# EAGLE schematic DRI_MainBoard (EAGLE 5.11)
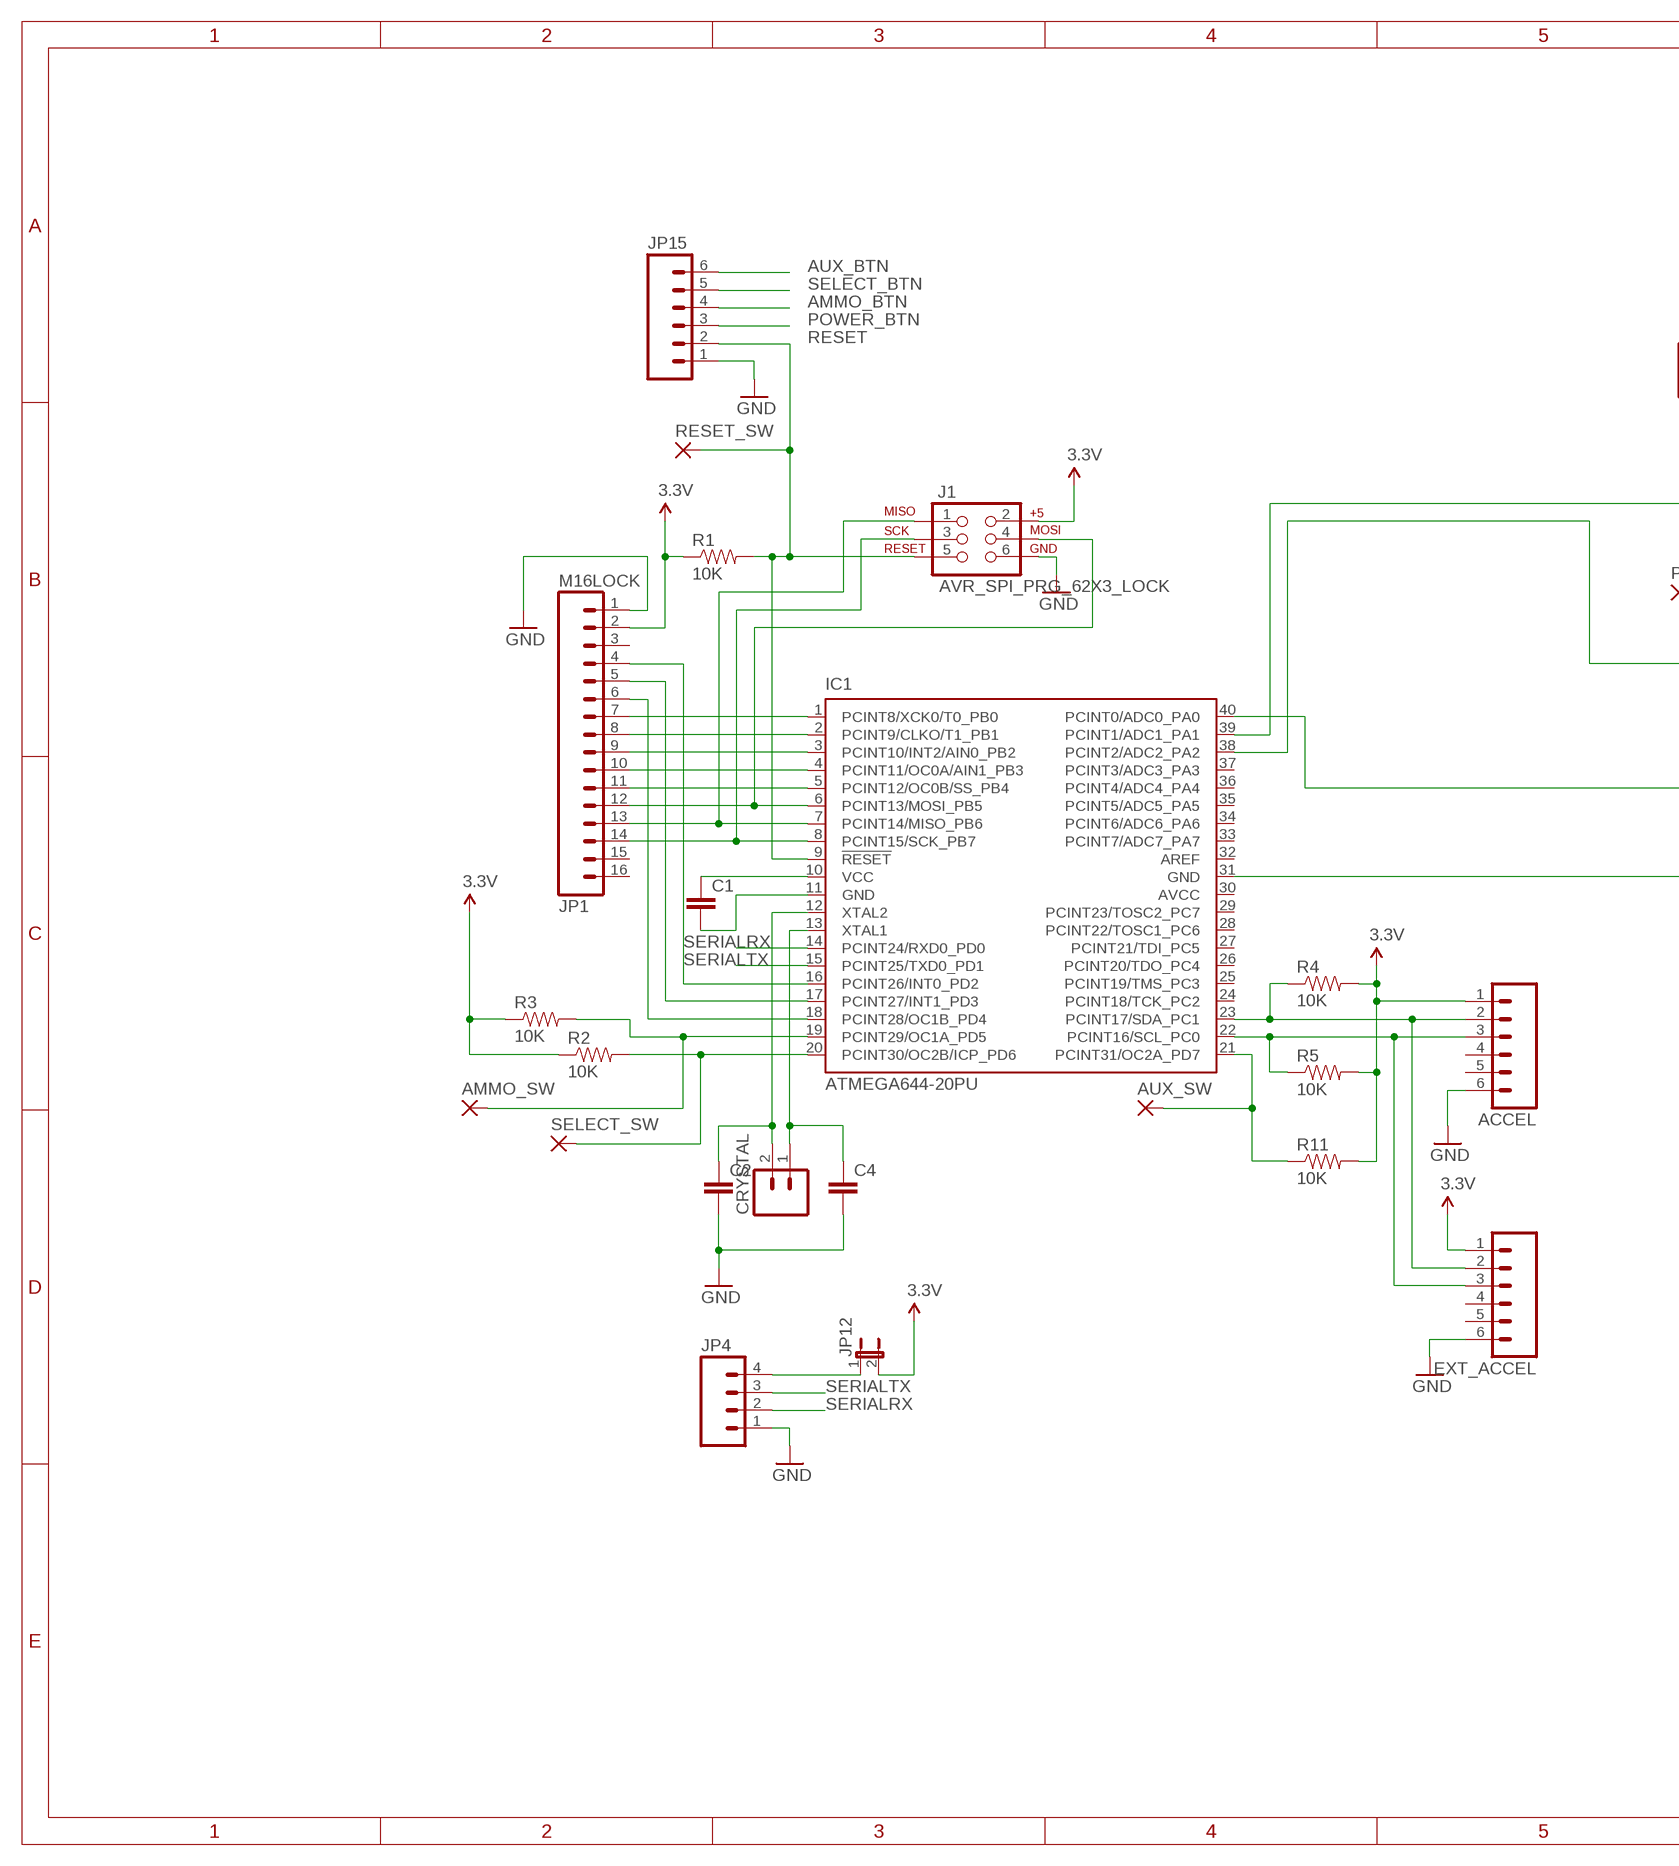
[diagram p0: schematic, sheet 1, part 1 of 2]
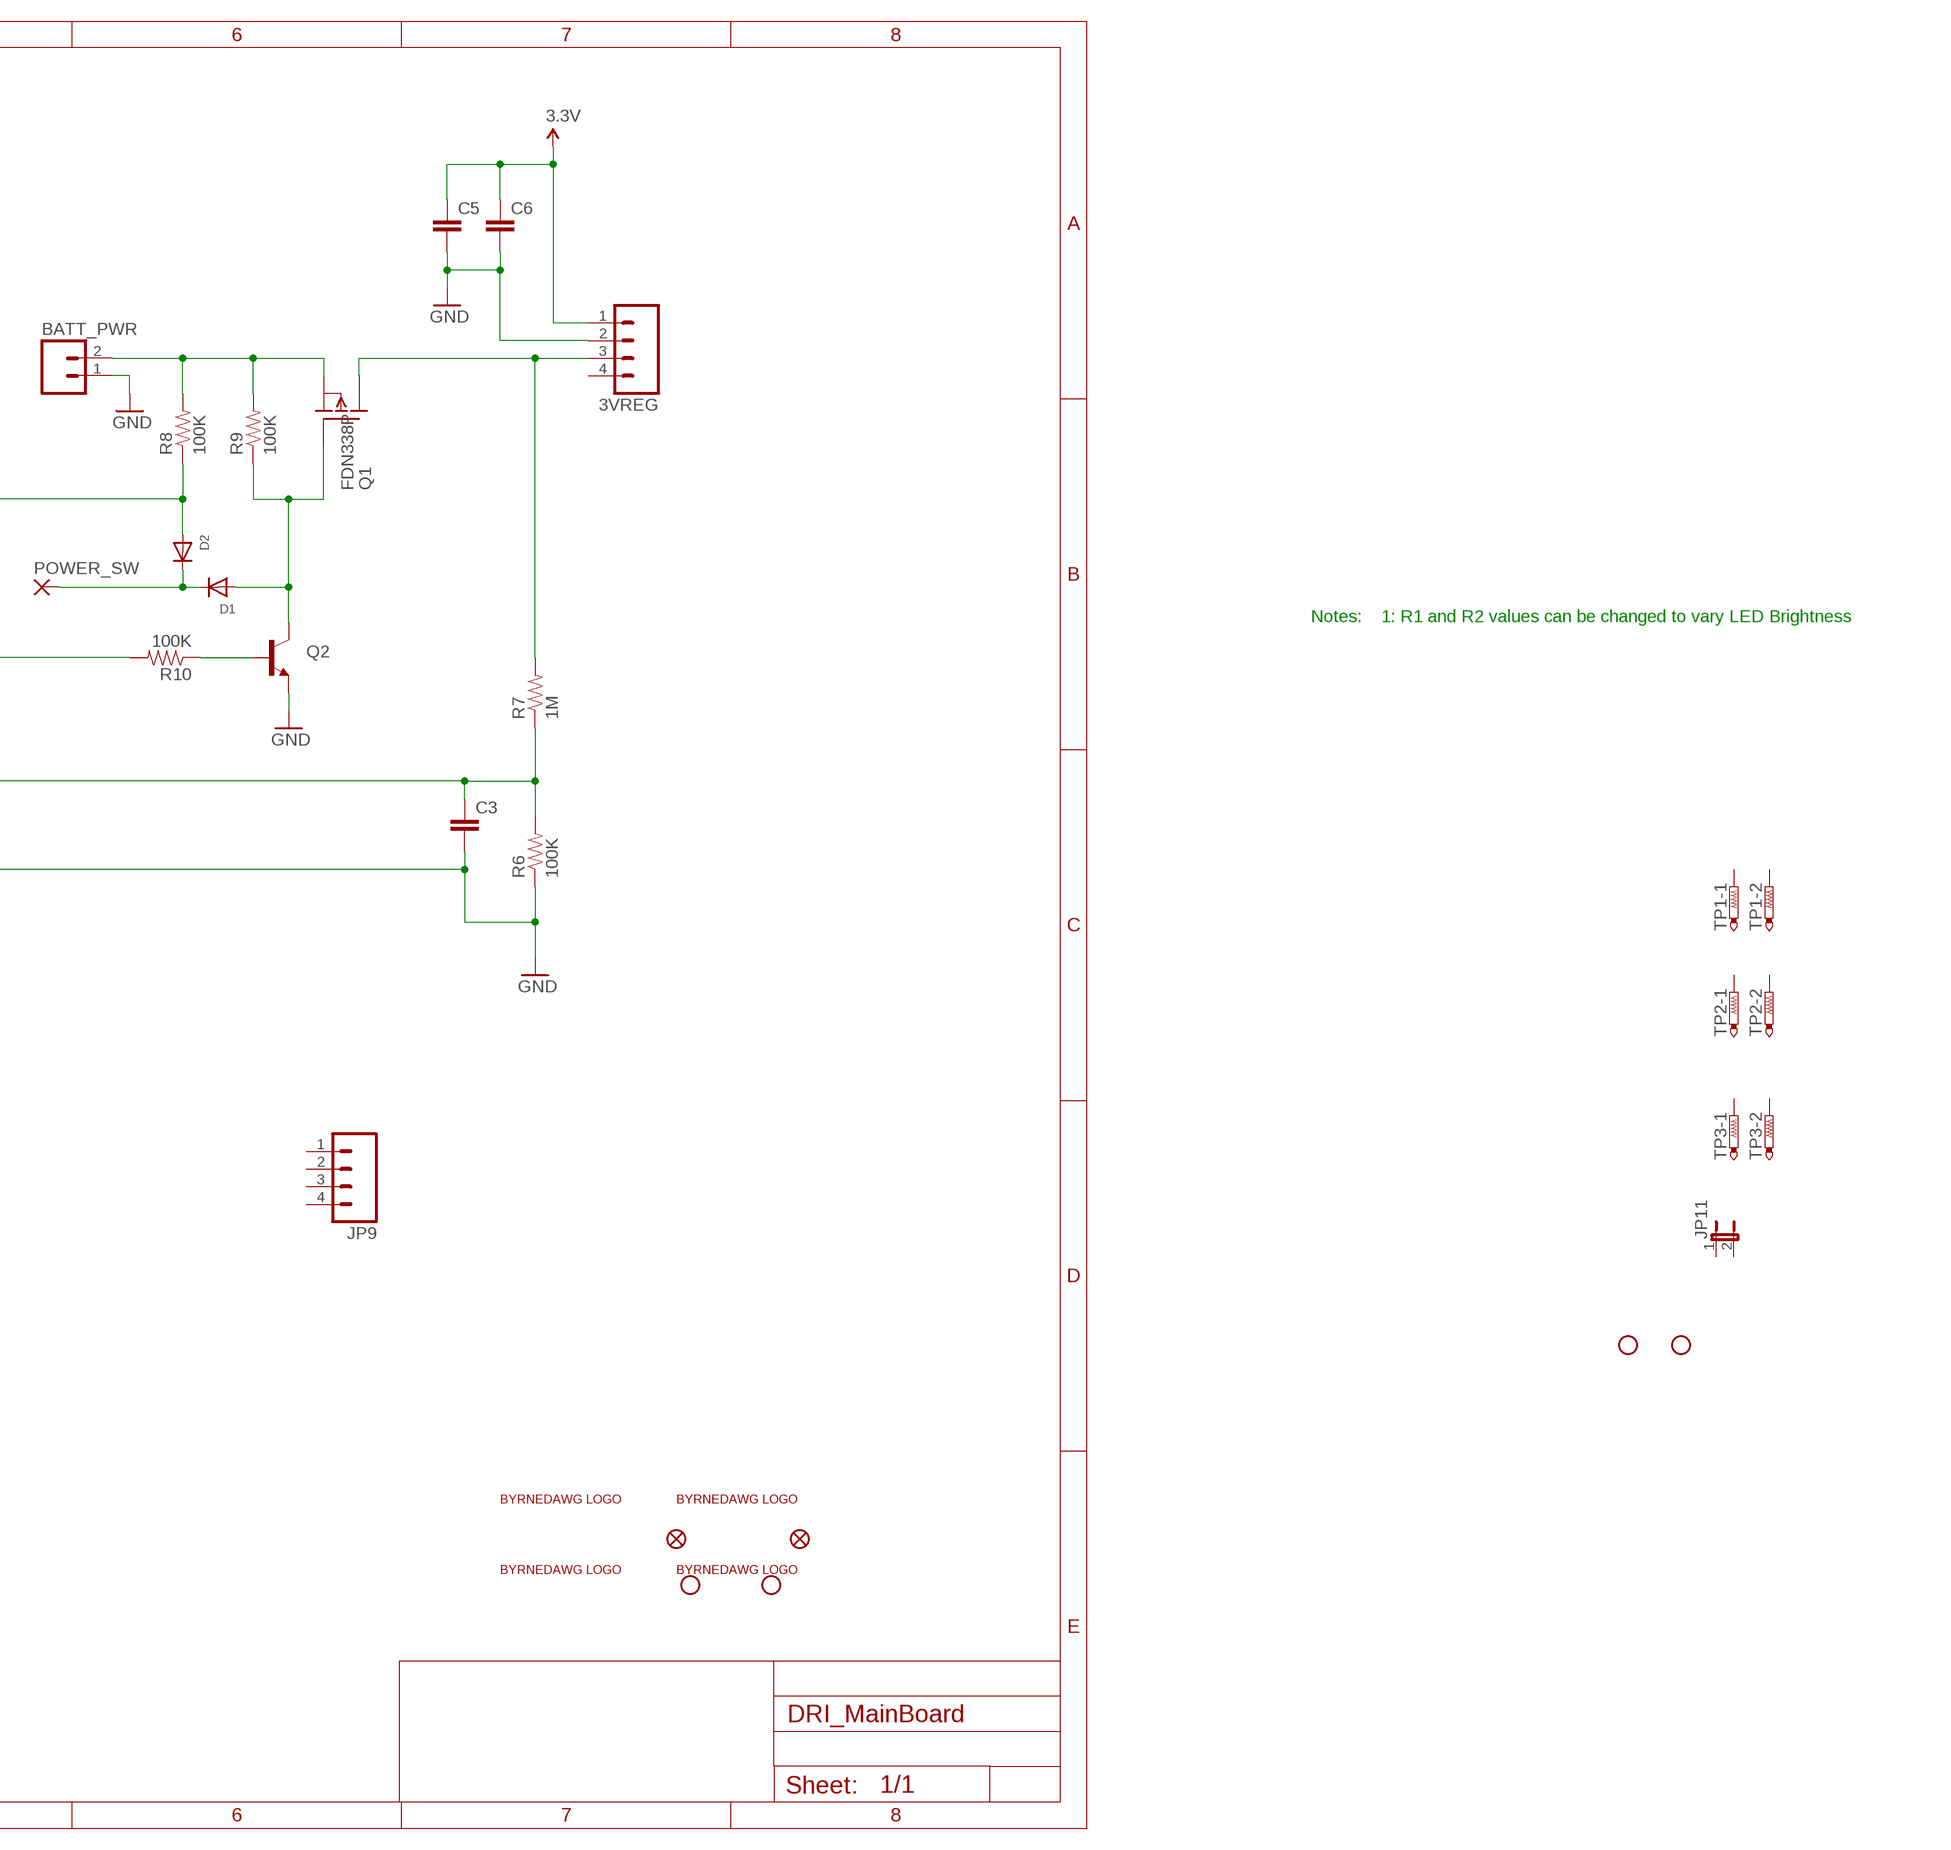
[diagram p1: schematic, sheet 1, part 2 of 2]

## Parts
3VREG  M04LOCK  [1X04_LOCK]
ACCEL  M06LOCK  [1X06_LOCK]
AMMO_SW  1,6/0,9  [1,6/0,9]
AUX_SW  1,6/0,9  [1,6/0,9]
BATT_PWR  M02PTH  [1X02]
C1  CAP1206  [1206]
C2  CAP1206  [1206]
C3  CAP1206  [1206]
C4  CAP1206  [1206]
C5  CAP1206  [1206]
C6  CAP1206  [1206]
CRYSTAL  M02PTH  [1X02]
D1  DIODESOD-123  [SOD-123]
D2  DIODESOD-123  [SOD-123]
EXT_ACCEL  M06LOCK  [1X06_LOCK]
IC1  ATMEGA644-20PU  [DIL40]
J1  AVR_SPI_PRG_62X3_LOCK  [2X3_LOCK]
JP1  M16LOCK  [1X16_LOCK]
JP2  FIDUCIAL1X2  [FIDUCIAL-1X2]
JP3  FIDUCIAL1X2  [FIDUCIAL-1X2]
JP4  M04LOCK  [1X04_LOCK]
JP6  STAND-OFF  [STAND-OFF]
JP7  STAND-OFF  [STAND-OFF]
JP9  M04LOCK  [1X04_LOCK]
JP11  JUMPER-2PTH  [1X02]
JP12  JUMPER-2PTH  [1X02]
JP13  STAND-OFF  [STAND-OFF]
JP14  STAND-OFF  [STAND-OFF]
JP15  M06LOCK  [1X06_LOCK]
POWER_SW  1,6/0,9  [1,6/0,9]
Q1  FDN338P  [SOT23]
Q2  TRANSISTOR_NPNSOT23  [SOT23]
R1  10K  RESISTOR1206  [1206]
R2  10K  RESISTOR1206  [1206]
R3  10K  RESISTOR1206  [1206]
R4  10K  RESISTOR1206  [1206]
R5  10K  RESISTOR1206  [1206]
R6  100K  RESISTOR1206  [1206]
R7  1M  RESISTOR1206  [1206]
R8  100K  RESISTOR1206  [1206]
R9  100K  RESISTOR1206  [1206]
R10  100K  RESISTOR1206  [1206]
R11  10K  RESISTOR1206  [1206]
RESET_SW  1,6/0,9  [1,6/0,9]
SELECT_SW  1,6/0,9  [1,6/0,9]
TP1  PTR2  [P2-38-17]
TP2  PTR2  [P2-38-17]
TP3  PTR2  [P2-38-17]
U$1  BYRNEDAWGBIG_LABEL  [BYRNEDAWGBIGLABEL]
U$2  BYRNEDAWGBIG_LABEL  [BYRNEDAWGBIGLABEL]
U$3  BYRNEDAWGBIG_LABEL  [BYRNEDAWGBIGLABEL]
U$4  BYRNEDAWGBIG_LABEL  [BYRNEDAWGBIGLABEL]

## Nets
3.3V: 3VREG.1 ACCEL.1 C1.1 C5.1 C6.1 EXT_ACCEL.1 IC1.10(VCC) J1.2 JP1.2 JP12.2 R1.1 R2.1 R3.1 R4.2 R5.2 R11.2
AMM0_BTN: AMMO_SW.1(P) IC1.19(PCINT29/OC1A_PD5) R3.2
AMMO_BTN: JP15.4
AUX_BTN: AUX_SW.1(P) IC1.21(PCINT31/OC2A_PD7) JP15.6 R11.1
BATT_POS: BATT_PWR.2 Q1.2(S) R8.2 R9.2
BATTVOLTCHECK: C3.1 IC1.40(PCINT0/ADC0_PA0) R6.2 R7.1
GND: 3VREG.2 ACCEL.6 BATT_PWR.1 C1.2 C2.2 C3.2 C4.2 C5.2 C6.2 EXT_ACCEL.6 IC1.11(GND) IC1.31(GND) J1.6 JP1.1 JP4.1 JP15.1 Q2.2(E) R6.1
N$2: IC1.17(PCINT27/INT1_PD3) JP1.5
N$3: IC1.16(PCINT26/INT0_PD2) JP1.4
N$4: IC1.1(PCINT8/XCK0/T0_PB0) JP1.7
N$5: IC1.2(PCINT9/CLKO/T1_PB1) JP1.8
N$6: IC1.3(PCINT10/INT2/AIN0_PB2) JP1.9
N$7: IC1.4(PCINT11/OC0A/AIN1_PB3) JP1.10
N$8: IC1.5(PCINT12/OC0B/SS_PB4) JP1.11
N$9: ACCEL.2 EXT_ACCEL.2 IC1.23(PCINT17/SDA_PC1) R4.1
N$10: IC1.7(PCINT14/MISO_PB6) J1.1 JP1.13
N$11: IC1.8(PCINT15/SCK_PB7) J1.3 JP1.14
N$12: JP4.4 JP12.1
N$13: C4.1 CRYSTAL.1 IC1.13(XTAL1)
N$14: C2.1 CRYSTAL.2 IC1.12(XTAL2)
N$15: IC1.18(PCINT28/OC1B_PD4) JP1.6
N$16: IC1.6(PCINT13/MOSI_PB5) J1.4 JP1.12
N$17: ACCEL.3 EXT_ACCEL.3 IC1.22(PCINT16/SCL_PC0) R5.1
N$18: D2.A IC1.39(PCINT1/ADC1_PA1) R8.1
N$19: IC1.38(PCINT2/ADC2_PA2) R10.2
N$22: D1.A Q1.1(G) Q2.3(C) R9.1
N$23: Q2.1(B) R10.1
POWER_BTN: D1.C D2.C JP15.3 POWER_SW.1(P)
RESET: IC1.9(!RESET) J1.5 JP15.2 R1.2 RESET_SW.1(P)
SELECT_BTN: IC1.20(PCINT30/OC2B/ICP_PD6) JP15.5 R2.2 SELECT_SW.1(P)
SERIALRX: IC1.14(PCINT24/RXD0_PD0) JP4.2
SERIALTX: IC1.15(PCINT25/TXD0_PD1) JP4.3
SWITCHED12V: 3VREG.3 Q1.3(D) R7.2
Unconnected: 3VREG.4 ACCEL.4 ACCEL.5 EXT_ACCEL.4 EXT_ACCEL.5 IC1.24(PCINT18/TCK_PC2) IC1.25(PCINT19/TMS_PC3) IC1.26(PCINT20/TDO_PC4) IC1.27(PCINT21/TDI_PC5) IC1.28(PCINT22/TOSC1_PC6) IC1.29(PCINT23/TOSC2_PC7) IC1.32(AREF) IC1.33(PCINT7/ADC7_PA7) IC1.34(PCINT6/ADC6_PA6) IC1.35(PCINT5/ADC5_PA5) IC1.36(PCINT4/ADC4_PA4) IC1.37(PCINT3/ADC3_PA3) JP1.3 JP1.15 JP1.16 JP9.1 JP9.2 JP9.3 JP9.4 JP11.1 JP11.2 TP1.TP-1 TP1.TP-2 TP2.TP-1 TP2.TP-2 TP3.TP-1 TP3.TP-2

## Notes on the sheet
- Notes: | 1: R1 and R2 values can be changed to vary LED Brightness

## Power pins joined to a net without a drawn wire
AVCC: IC1.30(AVCC)

## Library data of the parts
3VREG JP4 JP9 = SparkFun:M04: Header 4 Standard 4-pin 0.1" header. Use with straight break away headers (SKU : PRT-00116), right angle break away headers (PRT-00553), swiss pins (PRT-00743), machine pins (PRT-00117), and female headers (PRT-00115). Molex polarized connector foot print use with SKU : PRT-08231 with associated crimp pins and housings. 1MM SMD Version SKU: PRT-10208
ACCEL EXT_ACCEL JP15 = SparkFun:M06: Header 6 Standard 6-pin 0.1" header. Use with straight break away headers (SKU : PRT-00116), right angle break away headers (PRT-00553), swiss pins (PRT-00743), machine pins (PRT-00117), and female headers (PRT-00115). Molex polarized connector foot print use with SKU : PRT-08094 with associated crimp pins and housings. NOTES ON THE VARIANTS LOCK and LOCK_LONGPADS... This footprint was designed to help hold the alignment of a through-hole component (i.e. 6-pin header) while soldering it into place. You may notice that each hole has been shifted either up or down by 0.005 of an inch from it's more standard position (which is a perfectly straight line). This slight alteration caused the pins (the squares in the middle) to touch the edges of the holes. Because they are alternating, it causes a "brace" to hold the component in place. 0.005 has proven to be the perfect amount of "off-center" position when using our standard breakaway headers. Although looks a little odd when you look at the bare footprint, once you have a header in there, the alteration is very hard to notice. Also, if you push a header all the way into place, it is covered up entirely on the bottom side. This idea of altering the position of holes to aid alignment will be further integrated into the Sparkfun Library for other footprints. It can help hold any component with 3 or more connection pins.
AMMO_SW AUX_SW POWER_SW RESET_SW SELECT_SW = wirepad:1,6/0,9: THROUGH-HOLE PAD
BATT_PWR CRYSTAL = SparkFun:M02: Header 2 Standard 2-pin 0.1" header. Use with straight break away headers (SKU : PRT-00116), right angle break away headers (PRT-00553), swiss pins (PRT-00743), machine pins (PRT-00117), and female headers (PRT-00115). Molex polarized connector foot print use with SKU : PRT-08233 with associated crimp pins and housings.
C1-C6 = SparkFun:CAP: Capacitor Standard 0603 ceramic capacitor, and 0.1" leaded capacitor.
D1 D2 = adafruit:DIODE: Diode SMADIODE - SMA Surface Mount Package 20V 1A Schottky Diode Digikey: 641-1014-6-ND DO-1N4148 - Through Hole Small Current Diode SOD-123 20V 1 A (.5mV Vf) Schottky Diode - Digikey: MBRX120TPMSCT-ND SOD-323 10V 570mA (.38mV Vf, 3ns) Schottky Diode - Digikey: ZLLS410CT-ND SOD-523 30V 30mA Schottky Diode (RB751S-40TE61) - Digikey: RB751S-40TE61CT-ND SOT23-R/W - SOT23 Package (R = Solder Paste/Reflow Ovens, W = Hand-Soldering) BAT54Film 40V 300mA - Digikey: 497-7162-1-ND
IC1 = atmel:ATMEGA644-*PU: 8-bit Microcontroller with 64K Bytes In-System Programmable Flash Auto generated by make-symbol-device-package-bsdl.ulp Rev. 34 Source: http://www.atmel.com/dyn/resources/prod_documents/doc2593.pdf; MPN: ATMEGA644-20PU; OC_FARNELL: 1288340; OC_NEWARK: 23M5060
J1 = SparkFun:AVR_SPI_PRG_6: AVR ISP 6 Pin This is the reduced ISP connector for AVR programming. Common on Arduino. This footprint will take up less PCB space and can be used with a 10-pin to 6-pin adapter such as SKU: BOB-08508
JP1 = SparkFun:M16
JP2 JP3 = SparkFun:FIDUCIAL: Fiducial Alignment Points Various fiducial points for machine vision alignment.
JP6 JP7 JP13 JP14 = SparkFun:STAND-OFF: Stand Off This is the mechanical footprint for a #4 phillips button head screw. Use the keepout ring to avoid running the screw head into surrounding components. SKU : PRT-00447
JP11 JP12 = SparkFun:JUMPER-2: Jumper Basic 0.1" spaced jumper. Use with breakaway headers.
Q1 = fairchild-semic:FDN338P: P-Channel Enhancement MOSFET 2.5V
Q2 = SparkFun:TRANSISTOR_NPN: Transistor NPN BJT configuration in SOT23 package. MMBT2222 is the common NPN we use. Double check BCE configuration again layout.
R1-R11 = SparkFun:RESISTOR: Resistor Basic schematic elements and footprints for 0603, 1206, and PTH resistors.
TP1-TP3 = testpad:PTR2: TEST PIN
U$1-U$4 = logo:BYRNEDAWG